# Altium schematic sheet SOC_LOGIC.schdoc: =
size A3; Symbol: Sheet-Symbol_A4; Company: 嘉立创EDA; Version: V1.0; Page Size: A4; @Project Name: RK3568_LPD4X_120P_Core; @Page Count: 18; @Update Date: 2025-08-26; @Create Date: 2025-08-15; @Schematic Name: Schematic1; @Page No: 5; @Page Name: SOC_LOGIC; Device: Sheet-Symbol_A4; Border: 1; Title Block Position: 3; Width: 2338; Height: 1652; Region Start: 1; X Region Count: 6; Y Region Count: 4; Blade Width: 10; @Board Name: Board1; @Create Time: 13:45:16; @Update Time: 14:53:53; Organization: ORGANIZATION; Address1: ADDRESS 1; Address2: ADDRESS 2; Address3: ADDRESS 3; Address4: ADDRESS 4; SheetNumber: 8; SheetTotal: 28
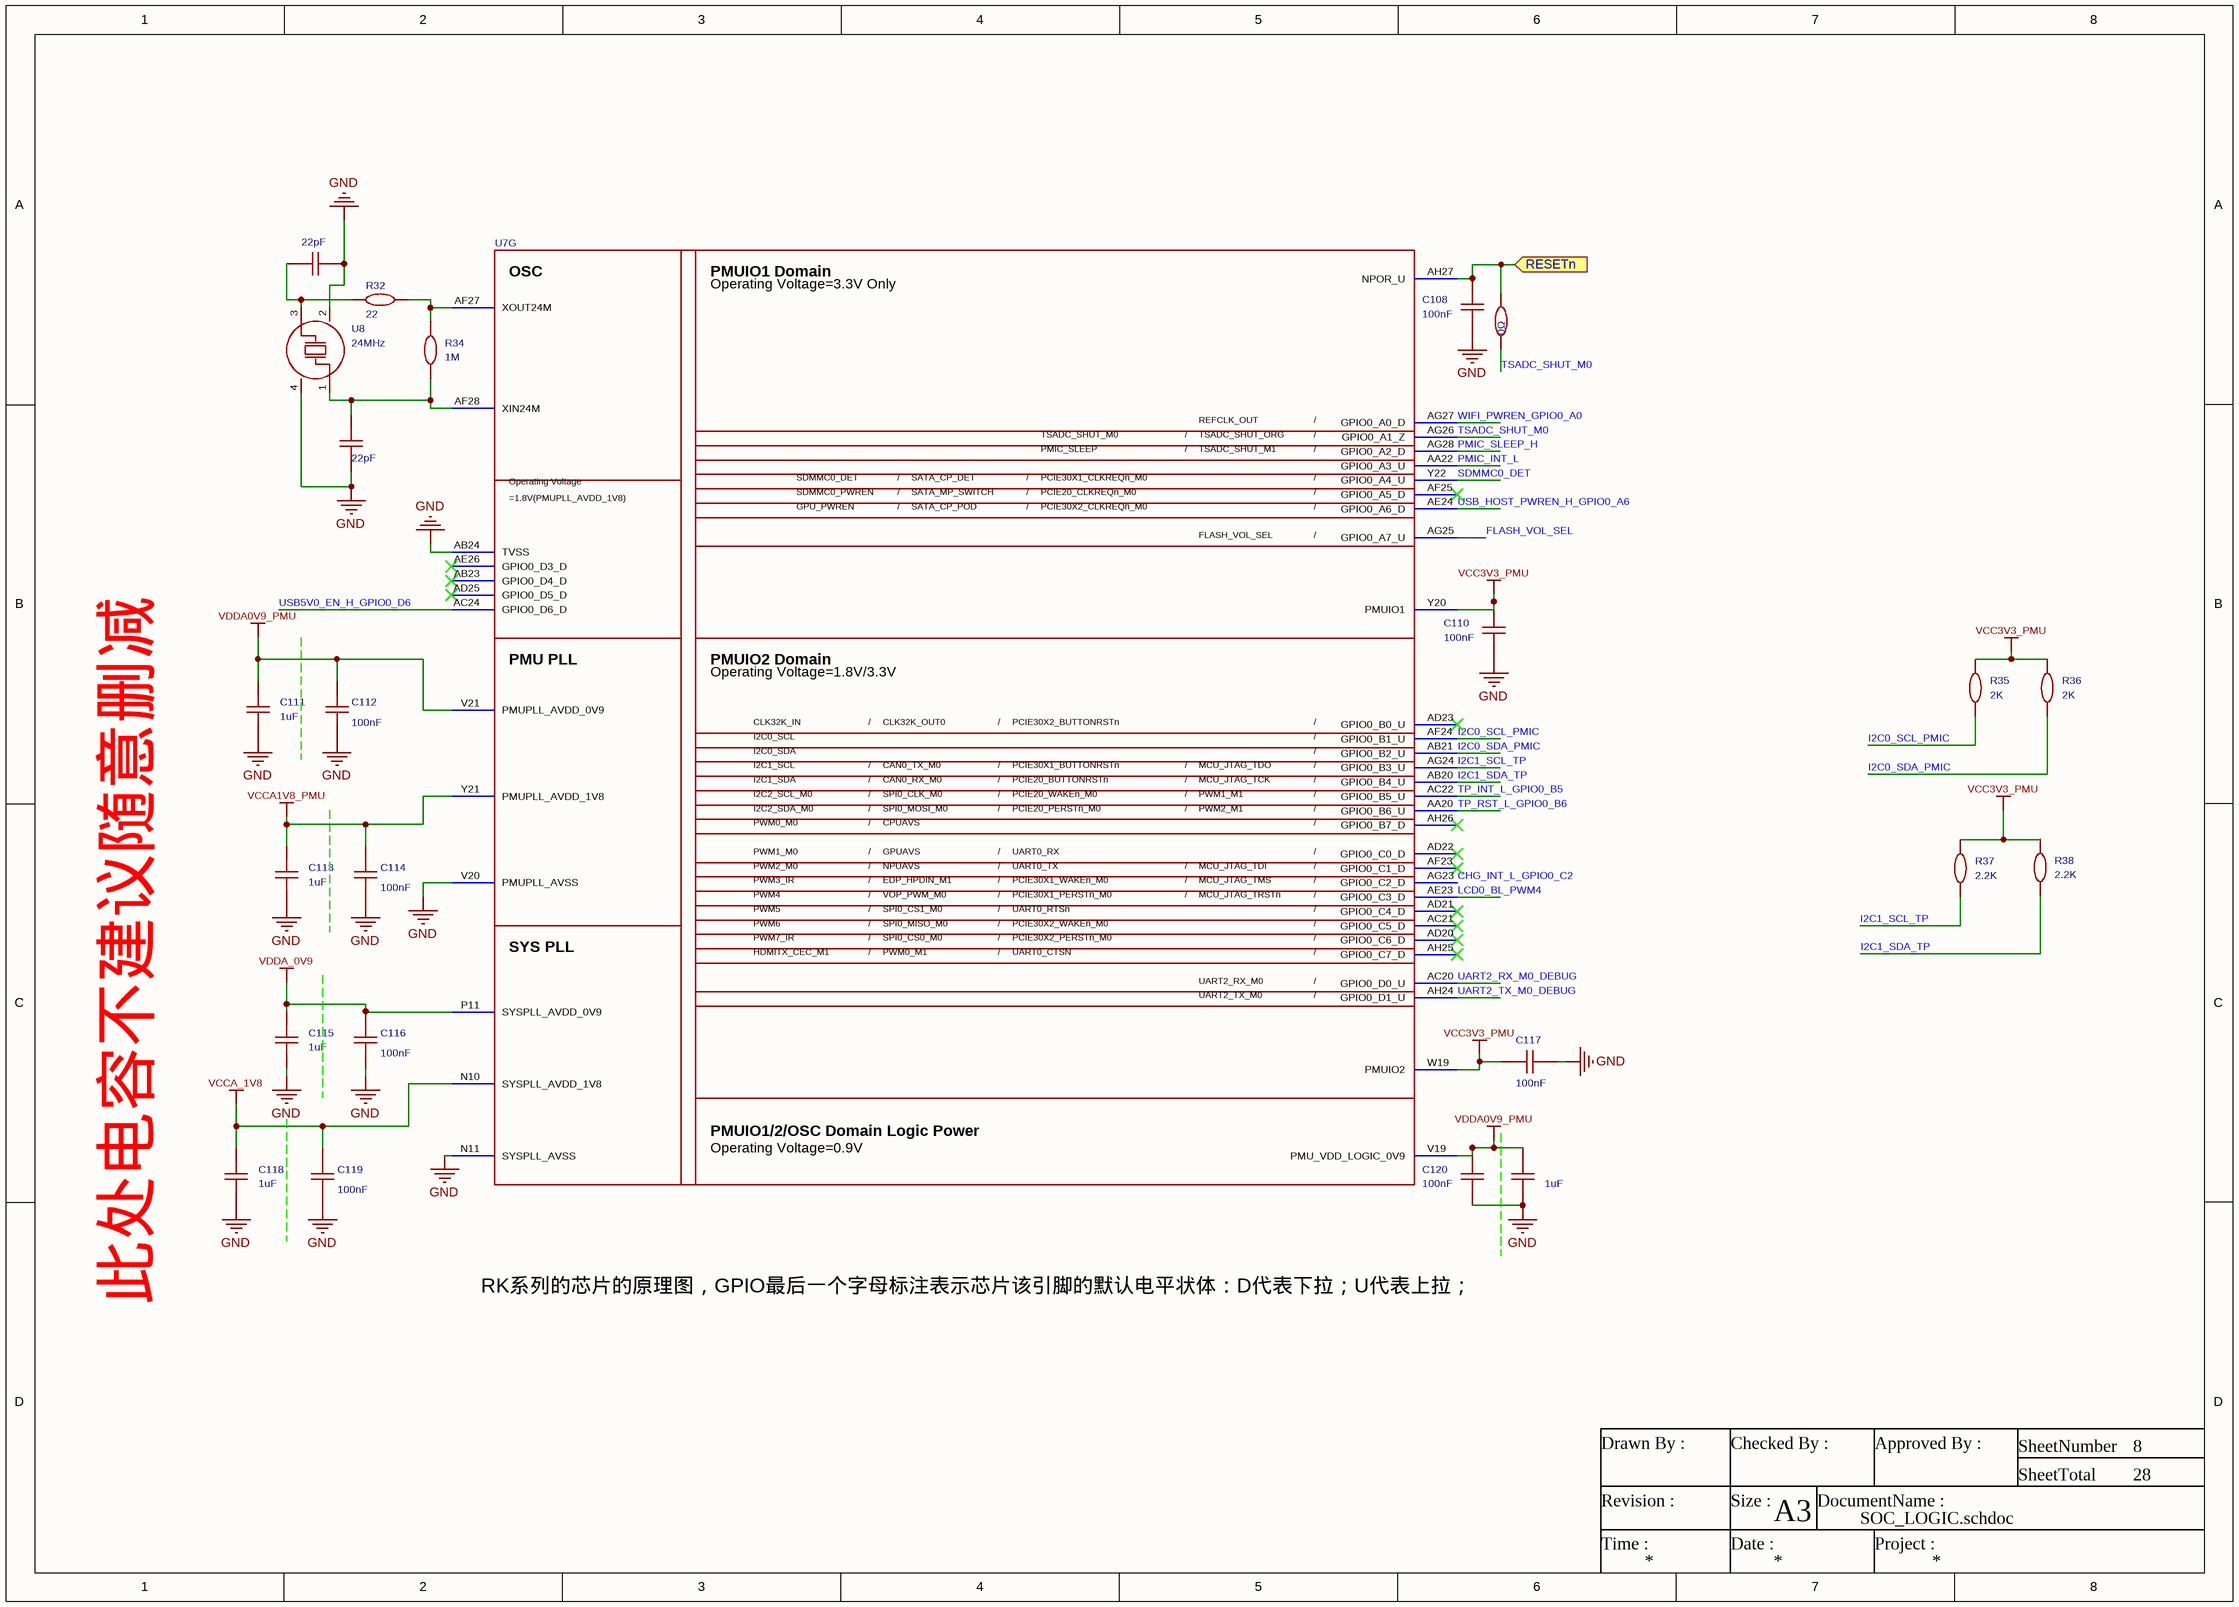
[diagram p0: SOC_LOGIC.schdoc]

## Parts
C107  value 22pF  [MYC0402]  (hidden comment: CL10C120JB8NNNC)
C108  100nF  [C0201]
C109  value 22pF  [MYC0402]  (hidden comment: CL10C120JB8NNNC)
C110  100nF  [C0201]
C111  value 1uF  [MYC0402]  (hidden comment: CL10A105KB8NNNC)
C112  100nF  [C0201]
C113  value 1uF  [MYC0402]  (hidden comment: CL10A105KB8NNNC)
C114  100nF  [C0201]
C115  value 1uF  [MYC0402]  (hidden comment: CL05B104KB54PNC)
C116  100nF  [C0201]
C117  100nF  [C0201]
C118  value 1uF  [MYC0402]  (hidden comment: CC0603KRX7R9BB104)
C119  100nF  [C0201]
C120  100nF  [C0201]
C121  value 1uF  [MYC0402]  (hidden comment: CL10A105KB8NNNC)
R32  22  [R0402]
R33  value 0Ω  [r0402-nsk]  (hidden comment: 0402WGF0000TCE)
R34  1M  [R0402]
R35  2K  [R0402]
R36  2K  [R0402]
R37  2.2K  [R0402]
R38  2.2K  [R0402]
U7  RK3568  [BGA-636_L19.0-W19.0-P0.65-BL]  (value not drawn)  (part G of 23)
U8  24MHz  [CRYSTAL-SMD_4P-L3.2-W2.5-BL]

## Ports
RESETn (in)

## Nets
GND: C107.2 C108.1 C109.1 C110.1 C111.1 C112.1 C113.1 C114.1 C115.1 C116.1 C117.1 C118.1 C119.1 C120.2 C121.1 U7.AB24(TVSS) U7.N11(SYSPLL_AVSS) U7.V20(PMUPLL_AVSS) U8.2(GND) U8.4(GND)
VCC3V3_PMU: C110.2 C117.2 R35.2 R36.2 R37.2 R38.2 U7.W19(PMUIO2) U7.Y20(PMUIO1)
VCCA1V8_PMU: C113.2 C114.2 U7.Y21(PMUPLL_AVDD_1V8)
VCCA_1V8: C118.2 C119.2 U7.N10(SYSPLL_AVDD_1V8)
VDDA0V9_PMU: C111.2 C112.2 C120.1 C121.2 U7.V19(PMU_VDD_LOGIC_0V9) U7.V21(PMUPLL_AVDD_0V9)
VDDA_0V9: C115.2 C116.2 U7.P11(SYSPLL_AVDD_0V9)
CHG_INT_L_GPIO0_C2: U7.AG23(GPIO0_C2_D)
FLASH_VOL_SEL: U7.AG25(GPIO0_A7_U)
I2C0_SCL_PMIC: R35.1 U7.AF24(GPIO0_B1_U)
I2C0_SDA_PMIC: R36.1 U7.AB21(GPIO0_B2_U)
I2C1_SCL_TP: R37.1 U7.AG24(GPIO0_B3_U)
I2C1_SDA_TP: R38.1 U7.AB20(GPIO0_B4_U)
LCD0_BL_PWM4: U7.AE23(GPIO0_C3_D)
PMIC_INT_L: U7.AA22(GPIO0_A3_U)
PMIC_SLEEP_H: U7.AG28(GPIO0_A2_D)
RESETn: C108.2 R33.2 U7.AH27(NPOR_U) ; port RESETn
SDMMC0_DET: U7.Y22(GPIO0_A4_U)
TP_INT_L_GPIO0_B5: U7.AC22(GPIO0_B5_U)
TP_RST_L_GPIO0_B6: U7.AA20(GPIO0_B6_U)
TSADC_SHUT_M0: R33.1 U7.AG26(GPIO0_A1_Z)
UART2_RX_M0_DEBUG: U7.AC20(GPIO0_D0_U)
UART2_TX_M0_DEBUG: U7.AH24(GPIO0_D1_U)
USB5V0_EN_H_GPIO0_D6: U7.AC24(GPIO0_D6_D)
USB_HOST_PWREN_H_GPIO0_A6: U7.AE24(GPIO0_A6_D)
WIFI_PWREN_GPIO0_A0: U7.AG27(GPIO0_A0_D)
NetC107_1: C107.1 R32.1 U8.3(OSC2)
NetC109_2: C109.2 R34.1 U7.AF28(XIN24M) U8.1(OSC1)
NetR32_2: R32.2 R34.2 U7.AF27(XOUT24M)

Not connected (* = marked no-connect by the designer): U7 AB23(GPIO0_D4_D)* AC21(GPIO0_C5_D)* AD20(GPIO0_C6_D)* AD21(GPIO0_C4_D)* AD22(GPIO0_C0_D)* AD23(GPIO0_B0_U)* AD25(GPIO0_D5_D)* AE26(GPIO0_D3_D)* AF23(GPIO0_C1_D)* AF25(GPIO0_A5_D)* AH25(GPIO0_C7_D)* AH26(GPIO0_B7_D)*

## Notes on the sheet
- 此处电容不建议随意删减
- RK系列的芯片的原理图，GPIO最后一个字母标注表示芯片该引脚的默认电平状体：D代表下拉；U代表上拉；
- Drawn By :
- Checked By :
- Approved By :
- SheetNumber
- SheetTotal
- Revision :
- Time :
- Size :
- Date :
- A3
- DocumentName :
- Project :
- (in symbol RK3568, part G) OSC; PMUIO1 Domain; Operating Voltage=3.3V Only; REFCLK_OUT; /; TSADC_SHUT_M0; TSADC_SHUT_ORG; PMIC_SLEEP; TSADC_SHUT_M1; Operating Voltage; SDMMC0_DET; SATA_CP_DET; PCIE30X1_CLKREQn_M0; SDMMC0_PWREN; SATA_MP_SWITCH; PCIE20_CLKREQn_M0; GPU_PWREN; SATA_CP_POD; PCIE30X2_CLKREQn_M0; FLASH_VOL_SEL; PMU PLL; PMUIO2 Domain; Operating Voltage=1.8V/3.3V; CLK32K_IN; CLK32K_OUT0; PCIE30X2_BUTTONRSTn; I2C0_SCL; I2C0_SDA; I2C1_SCL; CAN0_TX_M0; PCIE30X1_BUTTONRSTn; MCU_JTAG_TDO; I2C1_SDA; CAN0_RX_M0; PCIE20_BUTTONRSTn; MCU_JTAG_TCK; I2C2_SCL_M0; SPI0_CLK_M0; PCIE20_WAKEn_M0; PWM1_M1; I2C2_SDA_M0; SPI0_MOSI_M0; PCIE20_PERSTn_M0; PWM2_M1; PWM0_M0; CPUAVS; PWM1_M0; GPUAVS; UART0_RX; PWM2_M0; NPUAVS; UART0_TX; MCU_JTAG_TDI; PWM3_IR; EDP_HPDIN_M1; PCIE30X1_WAKEn_M0; MCU_JTAG_TMS; PWM4; VOP_PWM_M0; PCIE30X1_PERSTn_M0; MCU_JTAG_TRSTn; PWM5; SPI0_CS1_M0; UART0_RTSn; PWM6; SPI0_MISO_M0; PCIE30X2_WAKEn_M0; PWM7_IR; SPI0_CS0_M0; PCIE30X2_PERSTn_M0; SYS PLL; HDMITX_CEC_M1; PWM0_M1; UART0_CTSN; UART2_RX_M0; UART2_TX_M0; PMUIO1/2/OSC Domain Logic Power; Operating Voltage=0.9V

## Library data of the parts
C107 C109 = CL10C120JB8NNNC: 容值:12pF;精度:±5%;额定电压:50V;材质(温度系数):C0G;; Manufacturer: SAMSUNG(三星); Symbol: CapAcitance; AddInBom: yes; ModelId: ac125912035d415993ca9572d50418b1; ModelName: C0603_L1.6-W0.8-H0.8; ModelTransform: 62.992,31.496,0,0,0,0,0,0,0; Tolerance: ±5%; Voltage Rated: 50V; Temperature Coefficient: C0G; Device: CL10C120JB8NNNC; LCSC Part Name: 12pF ±5% 50V; ManufacturerPart: CL10C120JB8NNNC; Supplier Footprint: 0603; JLCPCB Part Class: Basic Part; Datasheet: https://atta.szlcsc.com/upload/public/pdf/source/20160218/1457707763339.pdf; Supplier: LCSC; ConvertToPcb: yes; FootprintName: MYC0402
C108 C110 C112 C114 C116 C117 C119 C120 = GRM035R60J475ME15D: 容值:4.7uF;精度:±20%;额定电压:6.3V;温度系数:X5R;; Manufacturer: muRata(村田); AddInBom: yes; ModelId: e8033a7cb35143ffb28e3b81b2577ea0; ModelName: C0201_L0.6-W0.3-H0.3; ModelTransform: 23.622,11.811,0,0,0,0,0,0,0; Tolerance: ±20%; Voltage Rating: 6.3V; Temperature Coefficient: X5R; Symbol: GRM035R60J475ME15D; Value: 100nF; Device: GRM035R60J475ME15D; LCSC Part Name: 4.7uF ±20% 6.3V; ManufacturerPart: GRM035R60J475ME15D; Supplier Footprint: 0201; JLCPCB Part Class: Extended Part; Datasheet: https://item.szlcsc.com/datasheet/GRM035R60J475ME15D/313624.html; Supplier: LCSC; ConvertToPcb: yes; FootprintName: C0201
C111 C113 = CL10A105KB8NNNC: 容值:1uF;精度:±10%;额定电压:50V;材质(温度系数):X5R;; Manufacturer: SAMSUNG(三星); Symbol: CapAcitance; AddInBom: yes; ModelId: ac125912035d415993ca9572d50418b1; ModelName: C0603_L1.6-W0.8-H0.8; ModelTransform: 62.992,31.496,0,0,0,0,0,0,0; Tolerance: ±10%; Voltage Rated: 50V; Temperature Coefficient: X5R; Device: CL10A105KB8NNNC; LCSC Part Name: 1uF ±10% 50V; SupplierPart: C15849; ManufacturerPart: CL10A105KB8NNNC; Supplier Footprint: 0603; JLCPCB Part Class: Basic Part; Datasheet: https://atta.szlcsc.com/upload/public/pdf/source/20160103/1457707679084.pdf; Supplier: LCSC; ConvertToPcb: yes; FootprintName: MYC0402
C115 = CL05B104KB54PNC: 容值:100nF;精度:±10%;额定电压:50V;材质(温度系数):X7R;; Manufacturer: SAMSUNG(三星); Symbol: CapAcitance; 3D Model: ac125912035d415993ca9572d50418b1; AddInBom: yes; ModelName: C0402_L1.0-W0.5-H0.5; ModelTransform: 39.37,19.685,0,0,0,0,0,0,0; Tolerance: ±10%; Voltage Rated: 50V; Temperature Coefficient: X7R; Device: CL05B104KB54PNC; LCSC Part Name: 100nF ±10% 50V; ManufacturerPart: CL05B104KB54PNC; Supplier Footprint: 0402; JLCPCB Part Class: Basic Part; Datasheet: https://atta.szlcsc.com/upload/public/pdf/source/20181009/C307331_222F7C870FD3EA5F46F538B483443886.pdf; Supplier: LCSC; ConvertToPcb: yes; FootprintName: MYC0402
C118 = CC0603KRX7R9BB104: 容值:100nF;精度:±10%;额定电压:50V;材质(温度系数):X7R;; Manufacturer: YAGEO(国巨); Symbol: CapAcitance; AddInBom: yes; ModelId: ac125912035d415993ca9572d50418b1; ModelName: C0603_L1.6-W0.8-H0.8; ModelTransform: 62.992,31.496,0,0,0,0,0,0,0; Tolerance: ±10%; Voltage Rated: 50V; Temperature Coefficient: X7R; Device: CC0603KRX7R9BB104; LCSC Part Name: 100nF ±10% 50V; ManufacturerPart: CC0603KRX7R9BB104; Supplier Footprint: 0603; JLCPCB Part Class: Basic Part; Datasheet: https://atta.szlcsc.com/upload/public/pdf/source/20180910/C282072_33301C7F631E79921B82A8DAC6BCC5B3.pdf; Supplier: LCSC; ConvertToPcb: yes; FootprintName: MYC0402
C121 = CL10A105KB8NNNC: 容值:1uF;精度:±10%;额定电压:50V;材质(温度系数):X5R;; Manufacturer: SAMSUNG(三星); Symbol: CapAcitance; 3D Model: 36a51122f27c49738f86b3bfa98863e0; AddInBom: yes; ModelName: C0603_L1.6-W0.8-H0.8; ModelTransform: 62.992,31.496,0,0,0,0,0,0,0; Tolerance: ±10%; Voltage Rated: 50V; Temperature Coefficient: X5R; Device: CL10A105KB8NNNC; LCSC Part Name: 1uF ±10% 50V; SupplierPart: C15849; ManufacturerPart: CL10A105KB8NNNC; Supplier Footprint: 0603; JLCPCB Part Class: Basic Part; Datasheet: https://atta.szlcsc.com/upload/public/pdf/source/20160103/1457707679084.pdf; Supplier: LCSC; ConvertToPcb: yes; FootprintName: MYC0402
R32 R34-R38 = Res_0402: Symbol: 电阻; ConvertToPcb: yes; ModelId: 671aefced39d4c318694bba8bd8efd39; ModelName: R0402_L1.0-W0.5-H0.5; ModelTransform: 39.37,19.685,0,0,0,0,0,0.0005,0; Device: Res_0402; AddInBom: yes; Supplier Footprint: 0402; FootprintName: R0402
  R32: Value: 22
  R34: Value: 1M
  R35 R36: Value: 2K
  R37 R38: Value: 2.2K
R33 = 0402WGF0000TCE: 电阻类型:厚膜电阻;阻值:0Ω;精度:±1%;功率:62.5mW;; Manufacturer: UNI-ROYAL(厚声); Symbol: 电阻; AddInBom: yes; ModelId: 671aefced39d4c318694bba8bd8efd39; ModelName: R0402_L1.0-W0.5-H0.5; ModelTransform: 39.37,19.685,0,0,0,0,0,0.0005,0; Tolerance: ±1%; Power(Watts): 62.5mW; Temperature Coefficient: ±800ppm/℃; Overload Voltage (Max): 50V; Device: 0402WGF0000TCE; LCSC Part Name: 0Ω ±1% 62.5mW; SupplierPart: C17168; ManufacturerPart: 0402WGF0000TCE; Supplier Footprint: 0402; JLCPCB Part Class: Basic Part; Datasheet: https://atta.szlcsc.com/upload/public/pdf/source/20200306/C422600_1E6D84923E4A46A82E41ADD87F860B5C.pdf; Supplier: LCSC; ConvertToPcb: yes; FootprintName: r0402-nsk; Type: 厚膜电阻; Operating Temperature Range: -55℃~+155℃
U7 = RK3568: ConvertToPcb: yes; ModelId: e6756cba1b9f43448429fdcd1d44d9d9; ModelTransform: 748.03,748.03,54.33,0,0,0,0,0,0; Symbol: RK3568; Device: RK3568; AddInBom: yes; FootprintName: BGA-636_L19.0-W19.0-P0.65-BL; ModelName: BGA-636_L19.0-W19.0-P0.65-BL
U8 = 3225 24M 12PF 10PPM: 频率:24MHz;常温频差:±10ppm;外接负载电容:12pF;频率稳定度(全温):±30ppm;; Manufacturer: SST(索斯特); AddInBom: yes; ModelId: 1840cb1b89674ca18acb69eedbab271b; ModelName: OSC-SMD_4P-L3.2-W2.5-H1.0; ModelTransform: 125.984,98.425,0,0,0,0,0,0,0; Normal temperature Frequency Tolerance: ±10ppm; External load capacitor: 12pF; Frequency Stability(Full temperature range): ±30ppm; Symbol: 3225 24M 12PF 10PPM; Device: 3225 24M 12PF 10PPM; LCSC Part Name: 24MHz ±10ppm 12pF; SupplierPart: C5181479; ManufacturerPart: 3225 24M 12PF 10PPM; Supplier Footprint: SMD3225-4P; JLCPCB Part Class: 扩展库; Datasheet: https://atta.szlcsc.com/upload/public/pdf/source/20220927/6DE882D78314C64B49594C58A0BA2E52.pdf; Supplier: LCSC; ConvertToPcb: yes; FootprintName: CRYSTAL-SMD_4P-L3.2-W2.5-BL; Value: 24MHz; Operating Temperature: -20℃~+70℃